# EAGLE design rc2usb (EAGLE 6.3)
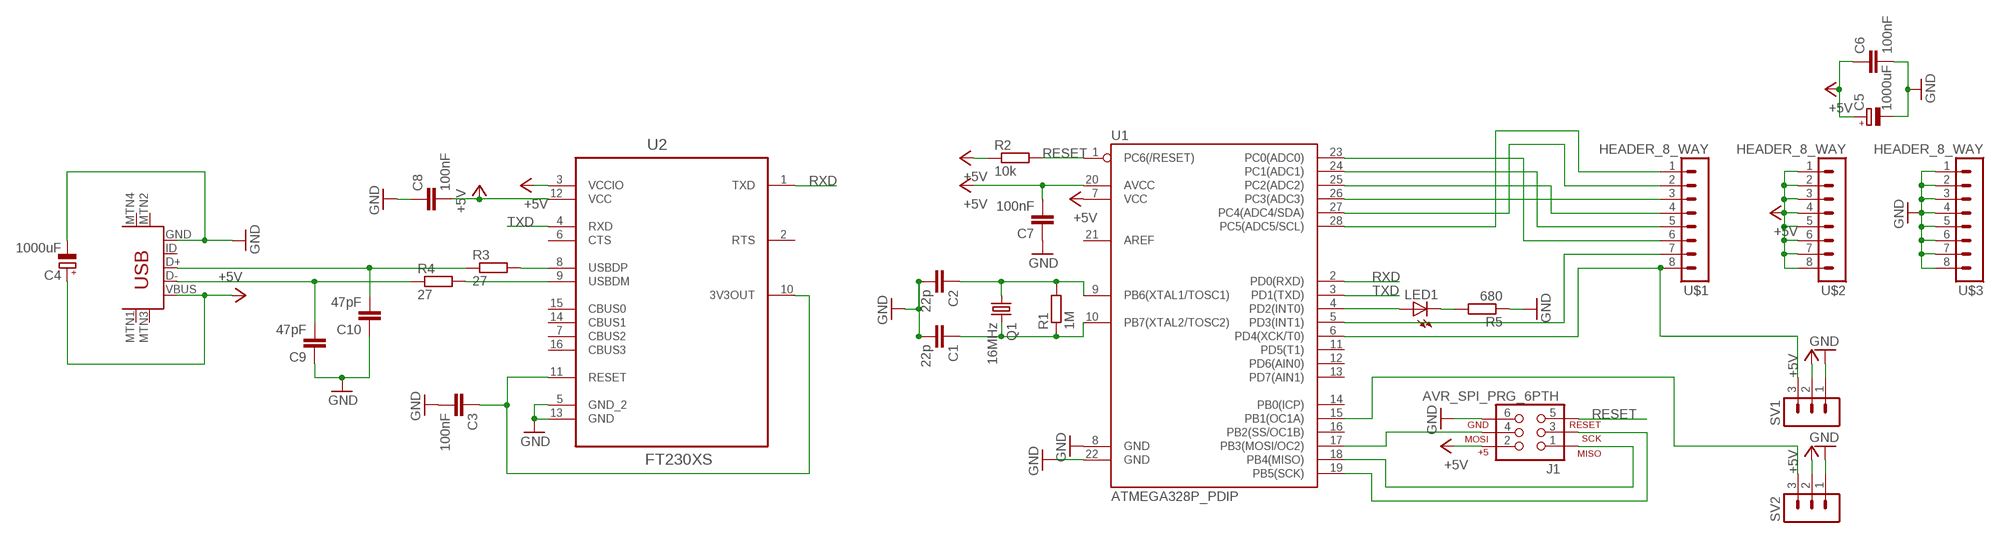
[diagram p0: schematic, sheet 1]

## Parts
C1  22p  C-EU025-040X050  [C025-040X050]
C2  22p  C-EU025-040X050  [C025-040X050]
C3  100nF  C-EU025-030X050  [C025-030X050]
C4  1000uF  CPOL-EUE5-10.5  [E5-10,5]
C5  1000uF  CPOL-EUE5-10.5  [E5-10,5]
C6  100nF  C-EU025-030X050  [C025-030X050]
C7  100nF  C-EU025-030X050  [C025-030X050]
C8  100nF  C-EU025-030X050  [C025-030X050]
C9  47pF  C-EU025-030X050  [C025-030X050]
C10  47pF  C-EU025-030X050  [C025-030X050]
J1  AVR_SPI_PRG_6PTH  [2X3]
LED1  LED5MM  [LED5MM]
Q1  16MHz  CRYSTALHC49U70  [HC49U70]
R1  1M  R-EU_0207/10  [0207/10]
R2  10k  R-EU_0207/10  [0207/10]
R3  27  R-EU_0207/10  [0207/10]
R4  27  R-EU_0207/10  [0207/10]
R5  680  R-EU_0207/10  [0207/10]
SV1  MA03-1  [MA03-1]
SV2  MA03-1  [MA03-1]
U1  ATMEGA328P_PDIP  [DIL28-3]
U2  FT230XS  [SOP63P600X175-16N]
U$1  HEADER_8_WAY  [HEADER_8_WAY]
U$2  HEADER_8_WAY  [HEADER_8_WAY]
U$3  HEADER_8_WAY  [HEADER_8_WAY]
U$4  USB-MINIB-5PIN  [USB-MINIB]

## Nets
+5V: C4.+ C5.+ C6.1 C7.2 C8.2 J1.2 R2.1 SV1.2 SV2.2 U1.7(VCC) U1.20(AVCC) U2.3(VCCIO) U2.12(VCC) U$2.1 U$2.2 U$2.3 U$2.4 U$2.5 U$2.6 U$2.7 U$2.8 U$4.VBUS
GND: C1.2 C2.2 C3.2 C4.- C5.- C6.2 C7.1 C8.1 C9.1 C10.1 J1.6 R5.1 SV1.1 SV2.1 U1.8(GND) U1.22(GND) U2.5(GND_2) U2.13(GND) U$3.1 U$3.2 U$3.3 U$3.4 U$3.5 U$3.6 U$3.7 U$3.8 U$4.GND
N$1: C2.1 Q1.1 R1.2 U1.9(PB6(XTAL1/TOSC1))
N$2: C1.1 Q1.2 R1.1 U1.10(PB7(XTAL2/TOSC2))
N$3: J1.4 U1.17(PB3(MOSI/OC2))
N$4: J1.1 U1.18(PB4(MISO))
N$5: J1.3 U1.19(PB5(SCK))
N$6: C10.2 R3.1 U$4.D+
N$7: C9.2 R4.1 U$4.D-
N$8: U1.24(PC1(ADC1)) U$1.5
N$9: R3.2 U2.8(USBDP)
N$10: LED1.A U1.4(PD2(INT0))
N$11: C3.1 U2.10(3V3OUT) U2.11(RESET)
N$12: R4.2 U2.9(USBDM)
N$14: U1.25(PC2(ADC2)) U$1.4
N$15: U1.26(PC3(ADC3)) U$1.3
N$16: U1.23(PC0(ADC0)) U$1.6
N$17: U1.27(PC4(ADC4/SDA)) U$1.2
N$18: U1.28(PC5(ADC5/SCL)) U$1.1
N$19: U1.5(PD3(INT1)) U$1.7
N$20: SV1.3 U1.6(PD4(XCK/T0)) U$1.8
N$22: SV2.3 U1.15(PB1(OC1A))
N$23: LED1.K(C) R5.2
RESET: J1.5 R2.2 U1.1(PC6(/RESET))
RXD: U1.2(PD0(RXD)) U2.1(TXD)
TXD: U1.3(PD1(TXD)) U2.4(RXD)
Unconnected: U1.11(PD5(T1)) U1.12(PD6(AIN0)) U1.13(PD7(AIN1)) U1.14(PB0(ICP)) U1.16(PB2(SS/OC1B)) U1.21(AREF) U2.2(RTS) U2.6(CTS) U2.7(CBUS2) U2.14(CBUS1) U2.15(CBUS0) U2.16(CBUS3) U$4.ID U$4.MTN1(MTN2) U$4.MTN2(MTN3) U$4.MTN3(MTN1) U$4.MTN4

## Library data of the parts
C1 C2 = resistor:C-EU: CAPACITOR, European symbol
C3 C6-C10 = rcl:C-EU: CAPACITOR, European symbol
C4 C5 = rcl:CPOL-EU: POLARIZED CAPACITOR, European symbol
J1 = SparkFun-Connectors:AVR_SPI_PRG_6: AVR ISP 6 Pin This is the reduced ISP connector for AVR programming. Common on Arduino. This footprint will take up less PCB space and can be used with a 10-pin to 6-pin adapter such as SKU: BOB-08508
LED1 = led:LED: LED OSRAM: - CHIPLED LG R971, LG N971, LY N971, LG Q971, LY Q971, LO R971, LY R971 LH N974, LH R974 LS Q976, LO Q976, LY Q976 LO Q996 - Hyper CHIPLED LW Q18S LB Q993, LB Q99A, LB R99A - SideLED LS A670, LO A670, LY A670, LG A670, LP A670 LB A673, LV A673, LT A673, LW A673 LH A674 LY A675 LS A676, LA A676, LO A676, LY A676, LW A676 LS A679, LY A679, LG A679 - Hyper Micro SIDELED® LS Y876, LA Y876, LO Y876, LY Y876 LT Y87S - SmartLED LW L88C, LW L88S LB L89C, LB L89S, LG L890 LS L89K, LO L89K, LY L89K LS L896, LA L896, LO L896, LY L896 - TOPLED LS T670, LO T670, LY T670, LG T670, LP T670 LSG T670, LSP T670, LSY T670, LOP T670, LYG T670 LG T671, LOG T671, LSG T671 LB T673, LV T673, LT T673, LW T673 LH T674 LS T676, LA T676, LO T676, LY T676, LB T676, LH T676, LSB T676, LW T676 LB T67C, LV T67C, LT T67C, LS T67K, LO T67K, LY T67K, LW E67C LS E67B, LA E67B, LO E67B, LY E67B, LB E67C, LV E67C, LT E67C LW T67C LS T679, LY T679, LG T679 LS T770, LO T770, LY T770, LG T770, LP T770 LB T773, LV T773, LT T773, LW T773 LH T774 LS E675, LA E675, LY E675, LS T675 LS T776, LA T776, LO T776, LY T776, LB T776 LHGB T686 LT T68C, LB T68C - Hyper Mini TOPLED® LB M676 - Mini TOPLED Santana® LG M470 LS M47K, LO M47K, LY M47K Source: http://www.osram.convergy.de LUXEON: - LUMILED® LXK2-PW12-R00, LXK2-PW12-S00, LXK2-PW14-U00, LXK2-PW14-V00 LXK2-PM12-R00, LXK2-PM12-S00, LXK2-PM14-U00 LXK2-PE12-Q00, LXK2-PE12-R00, LXK2-PE12-S00, LXK2-PE14-T00, LXK2-PE14-U00 LXK2-PB12-K00, LXK2-PB12-L00, LXK2-PB12-M00, LXK2-PB14-N00, LXK2-PB14-P00, LXK2-PB14-Q00 LXK2-PR12-L00, LXK2-PR12-M00, LXK2-PR14-Q00, LXK2-PR14-R00 LXK2-PD12-Q00, LXK2-PD12-R00, LXK2-PD12-S00 LXK2-PH12-R00, LXK2-PH12-S00 LXK2-PL12-P00, LXK2-PL12-Q00, LXK2-PL12-R00 Source: www.luxeon.com KINGBRIGHT: KA-3528ASYC Source: www.kingbright.com
Q1 = crystal:CRYSTAL: CRYSTAL; OC_FARNELL: unknown; OC_NEWARK: unknown
R1-R5 = resistor:R-EU_: RESISTOR, European symbol
SV1 SV2 = con-lstb:MA03-1: PIN HEADER; OC_FARNELL: unknown; OC_NEWARK: unknown
U1 = SparkFun-DigitalIC:ATMEGA328P_PDIP: uC used in the Arduino 32kb flash, 1k EEPROM, 2k SRAM This is the through-hole version of this chip.
U2 = rc2usb:FT230XS: I/F, USB2.0 FS TO BASIC UART; MPN: FT230XS; OC_FARNELL: 2081321; OC_NEWARK: 83T7087; PACKAGE: SSOP-16; SUPPLIER: FTDI
U$1-U$3 = rc2usb:HEADER_8_WAY
U$4 = SparkFun-Connectors:USB-MINIB: Mini-USB "B" connector with 5th pin broken out. Created new symbol breaking out 5th "ID" pin in mini/micro USB connector spec. See: http://en.wikipedia.org/wiki/Mini_usb#Cables. Uses same footprint as 4-pin symbol. Also added pins to connect to mounting / shield pads if required (probably not generally needed as signals aren't shielded once they leave the connector).

## Board
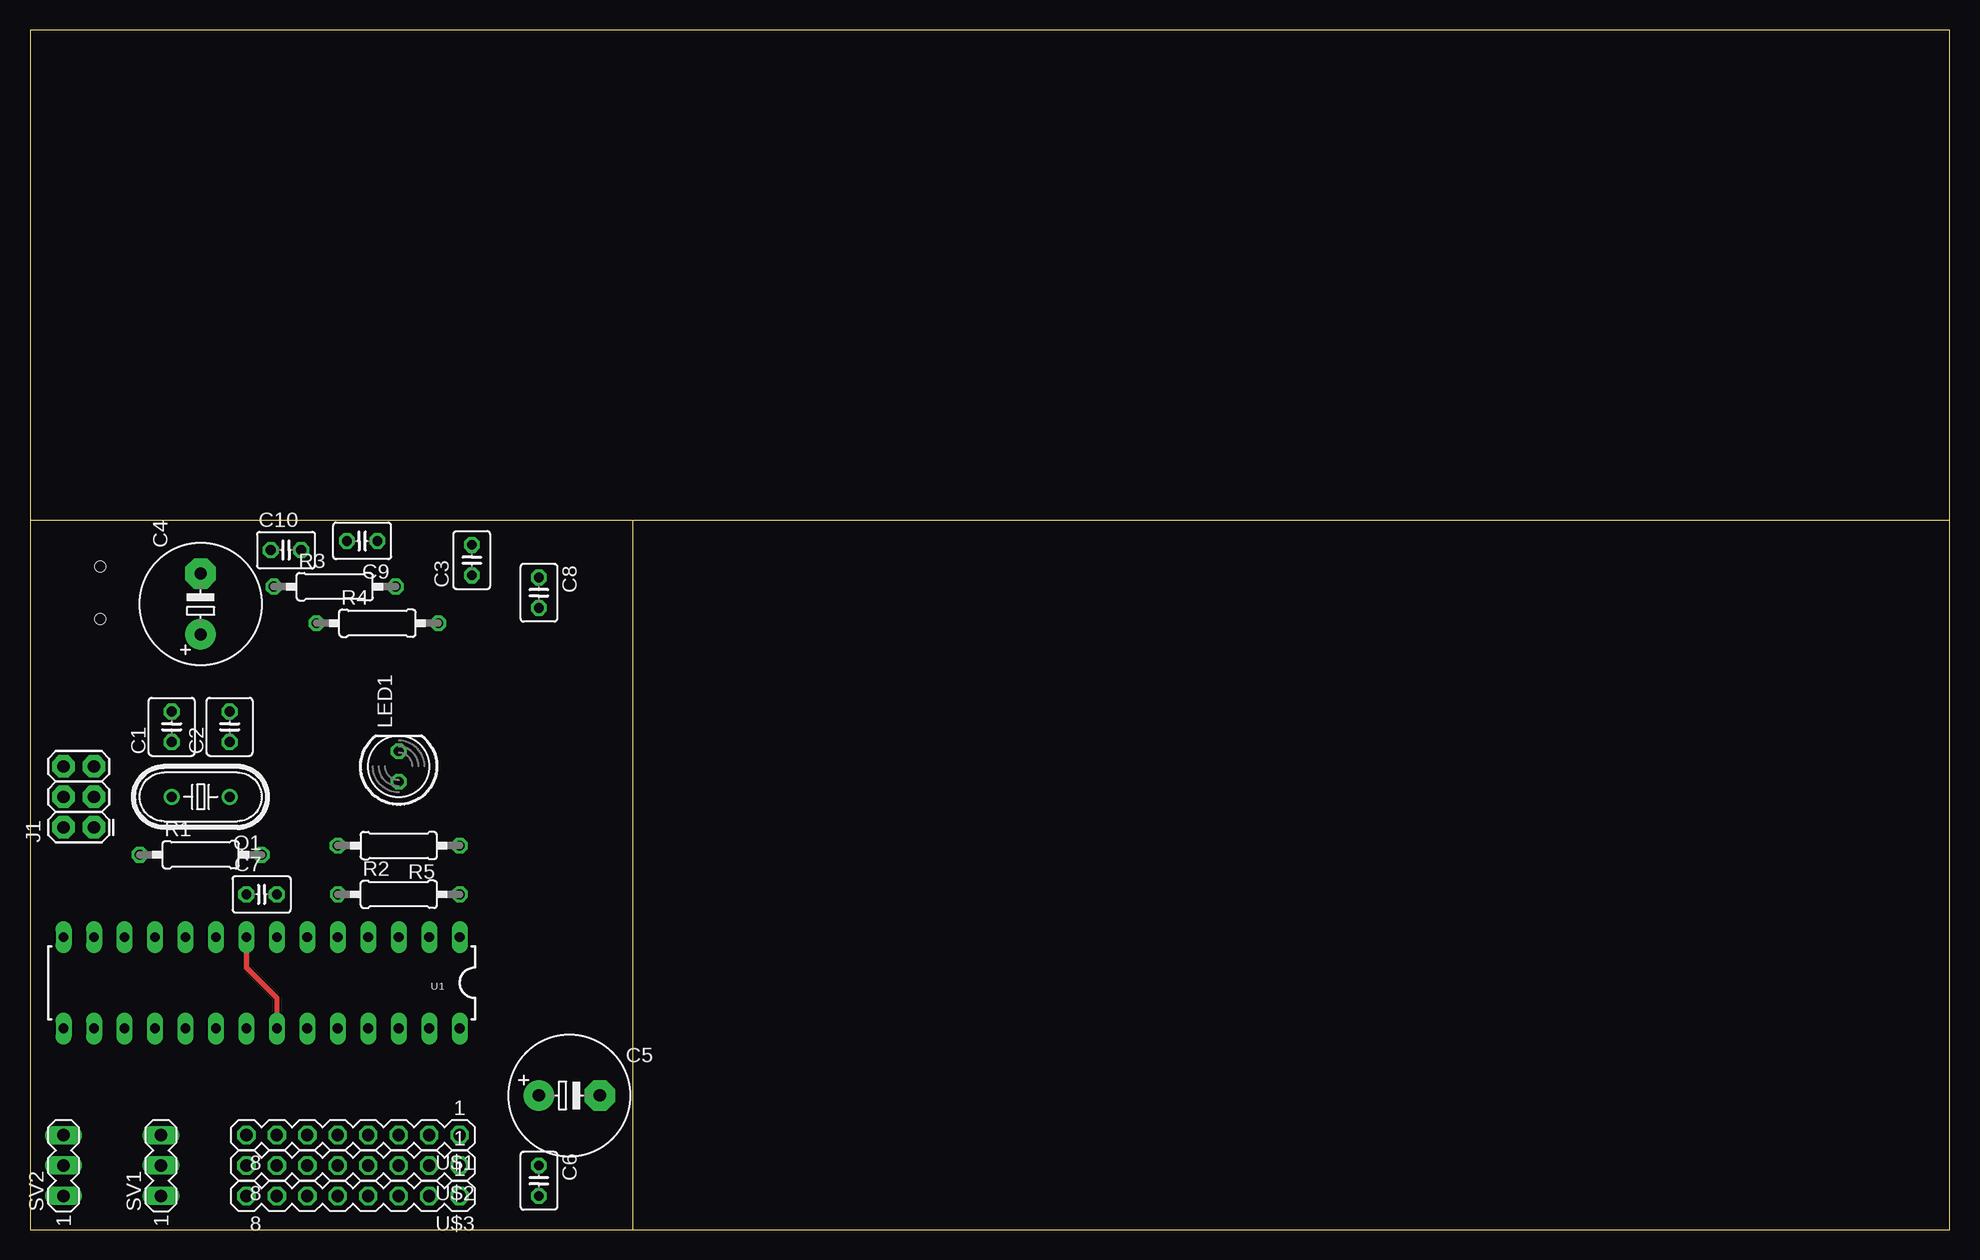
[diagram p1: board, top side]
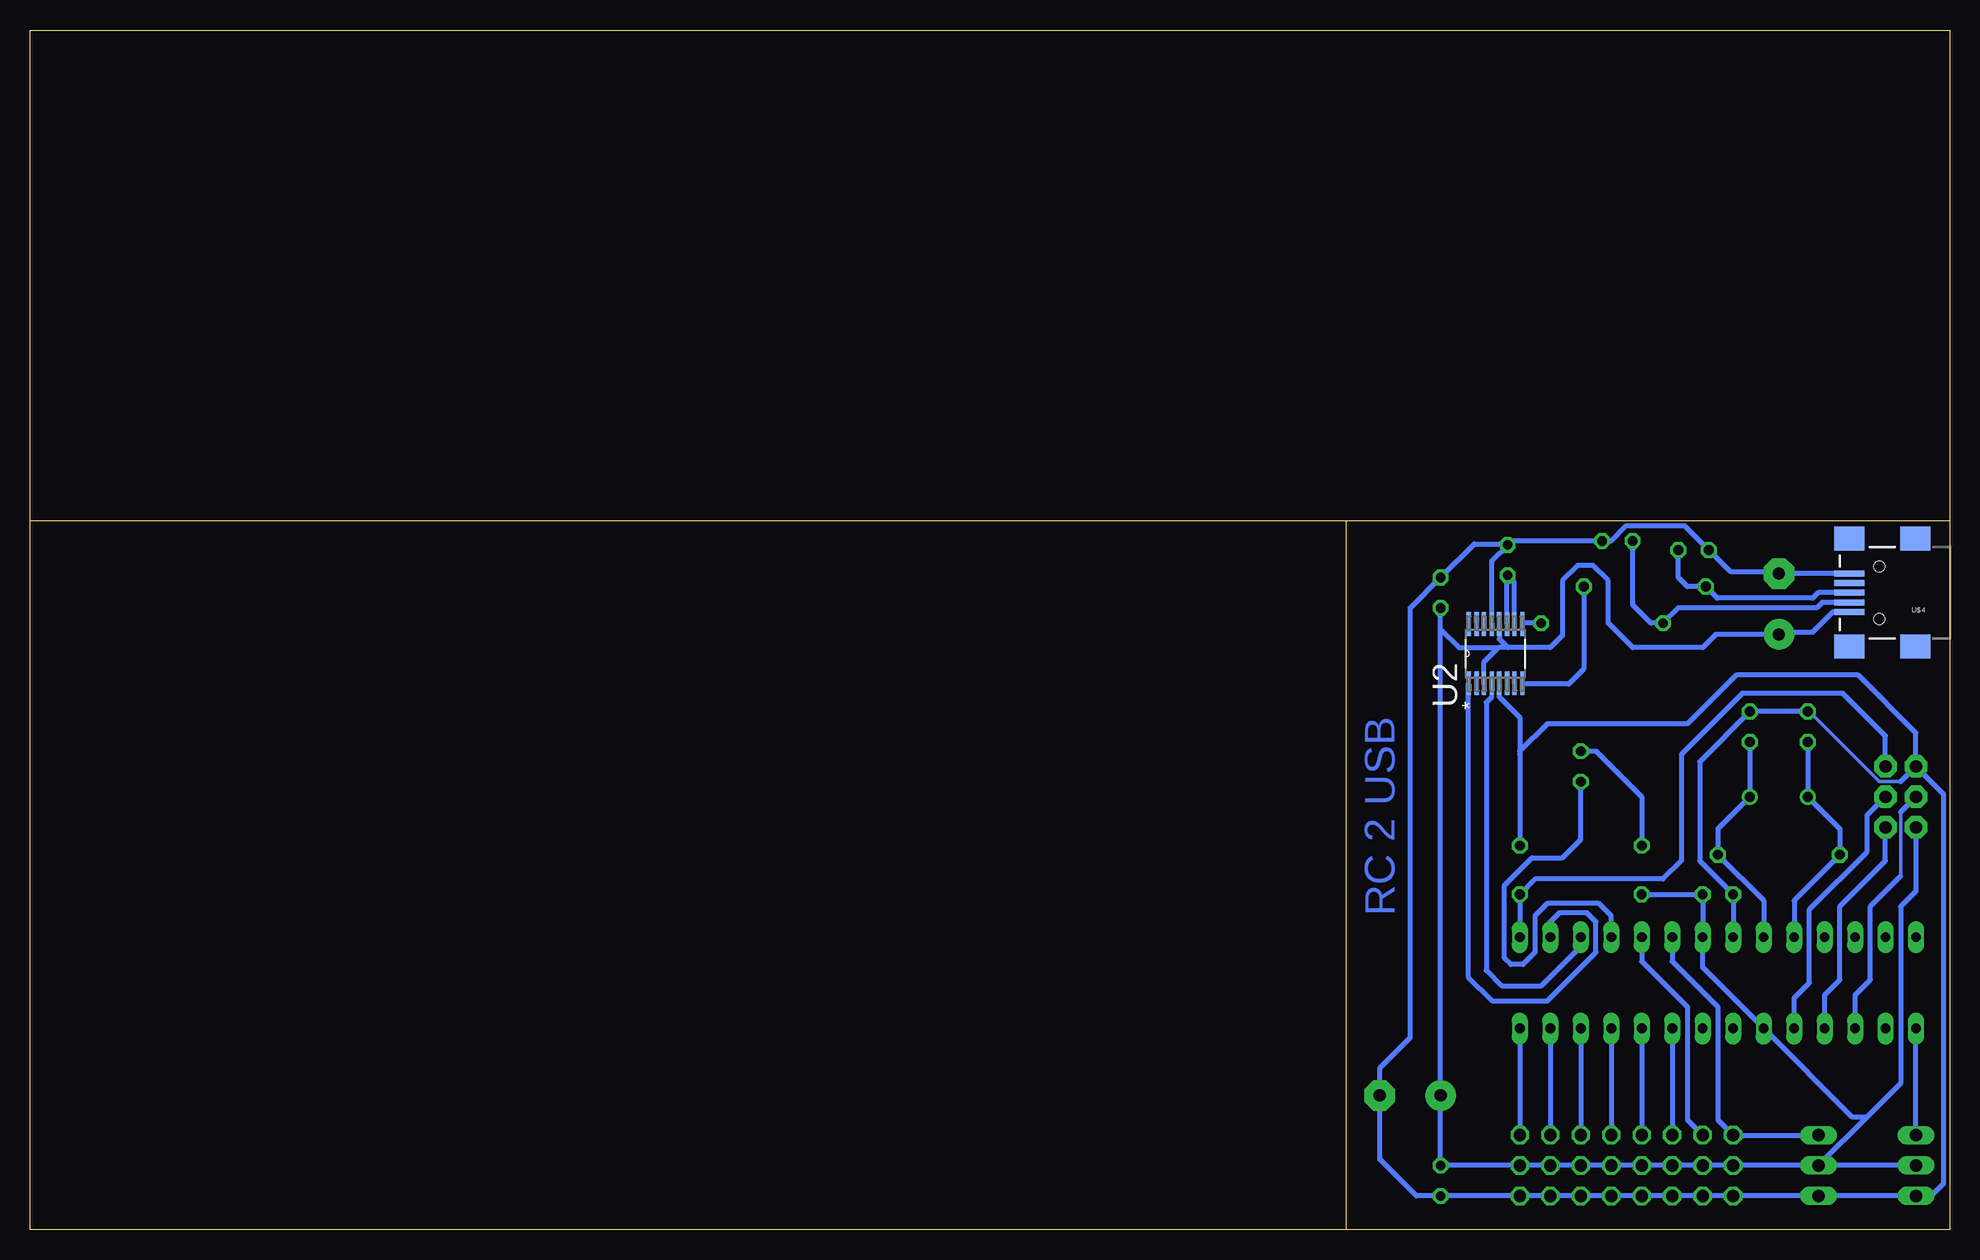
[diagram p2: board, bottom side, seen from below]

Size 160 x 100 mm. Coordinates in mm from the lower left corner, seen from the top.
Outline: 50.27,0 0,0 0,59.11
Outline: 50.27,0 160,0 160,59.11
Outline: 160,59.11 160,100 0,100 0,59.11
Outline: 160,59.11 50.27,59.11
Outline: 50.27,59.11 0,59.11
Outline: 50.27,0 50.27,59.11
Copper layers (1*16): Top 0.035mm / dielectric 1.5mm / Bottom 0.035mm
Design rules "default": minimum track width 10mil, minimum drill 24mil, track to track 8mil, track to pad 8mil, pad to pad 8mil, via to via 8mil, smd to smd 8mil, copper to edge 40mil, drill to drill 8mil, minimum pad ring 10mil, minimum via ring 8mil, stop-mask expansion 4mil, vias tented up to drill 0mil, thermal gap 10mil

### Footprints (pad centres in the part's own frame; a part is rotated, then mirrored left to right if it is on the bottom)
C025-040X050 = drill 0.813 octagon: 1 -1.27,0; 2 1.27,0
C025-030X050 = drill 0.813 octagon: 1 -1.27,0; 2 1.27,0
E5-10,5 = drill 1.016 pad 2.54: + -2.54,0 | drill 1.016 pad 2.54 octagon: - 2.54,0
2X3 = drill 1.016 pad 1.88 octagon: 1 0,0; 2 0,2.54; 3 2.54,0; 4 2.54,2.54; 5 5.08,0; 6 5.08,2.54
LED5MM = drill 0.813 octagon: A -1.27,0; K 1.27,0
HC49U70 = drill 0.813: 1 -2.413,0; 2 2.413,0
0207/10 = drill 0.813 octagon: 1 -5.08,0; 2 5.08,0
MA03-1 = drill 1.016 long: 1 -2.54,0; 2 0,0; 3 2.54,0
DIL28-3 = drill 0.813 long: 1 -16.51,-3.81; 2 -13.97,-3.81; 3 -11.43,-3.81; 4 -8.89,-3.81; 5 -6.35,-3.81; 6 -3.81,-3.81; 7 -1.27,-3.81; 8 1.27,-3.81; 9 3.81,-3.81; 10 6.35,-3.81; 11 8.89,-3.81; 12 11.43,-3.81; 13 13.97,-3.81; 14 16.51,-3.81; 15 16.51,3.81; 16 13.97,3.81; 17 11.43,3.81; 18 8.89,3.81; 19 6.35,3.81; 20 3.81,3.81; 21 1.27,3.81; 22 -1.27,3.81; 23 -3.81,3.81; 24 -6.35,3.81; 25 -8.89,3.81; 26 -11.43,3.81; 27 -13.97,3.81; 28 -16.51,3.81
SOP63P600X175-16N = smd 1.981 x 0.356: 1 -2.464,2.235; 2 -2.464,1.575; 3 -2.464,0.965; 4 -2.464,0.305; 5 -2.464,-0.305; 6 -2.464,-0.965; 7 -2.464,-1.575; 8 -2.464,-2.235; 9 2.464,-2.235; 10 2.464,-1.575; 11 2.464,-0.965; 12 2.464,-0.305; 13 2.464,0.305; 14 2.464,0.965; 15 2.464,1.575; 16 2.464,2.235
HEADER_8_WAY = drill 1.016 octagon: 1 -8.89,0; 2 -6.35,0; 3 -3.81,0; 4 -1.27,0; 5 1.27,0; 6 3.81,0; 7 6.35,0; 8 8.89,0
USB-MINIB = smd 2.5 x 0.5: D+ 2.5,0; D- 2.5,0.8; GND 2.5,-1.6; ID 2.5,-0.8; VBUS 2.5,1.6 | smd 2.5 x 2: MTN1 -3,4.5; MTN2 2.5,4.5; MTN3 -3,-4.5; MTN4 2.5,-4.5 | hole 0.9: 0,2.2; 0,-2.2

### Placement (x,y rotation side)
C1  11.81,41.91 90 top
C2  16.64,41.91 90 top
C3  36.83,55.8 90 top
C4  14.22,52.15 90 top
C5  44.96,11.18 0 top
C6  42.42,4.06 270 top
C7  19.3,27.94 0 top
C8  42.42,53.09 270 top
C9  27.69,57.4 180 top
C10  21.34,56.64 0 top
J1  5.33,33.53 90 top
LED1  30.73,38.61 90 top
Q1  14.22,36.07 180 top
R1  14.22,31.24 0 top
R2  30.74,27.94 0 top
R3  25.4,53.59 0 top
R4  28.96,50.55 0 top
R5  30.73,32 180 top
SV1  10.92,5.33 90 top
SV2  2.79,5.33 90 top
U1  19.3,20.57 180 top
U2  37.85,48.01 90 bottom
U$1  26.92,7.87 180 top
U$2  26.92,5.33 180 top
U$3  26.92,2.79 180 top
U$4  5.84,53.09 180 bottom

### Tracks (layer width: path | path; a pad name or v marks a point on that pad's centre or on a via)
+5V
  Bottom 0.406: SV2.2 SV1.2 | SV1.2 U$2.8 U$2.7 U$2.6 U$2.5 U$2.4 U$2.3 U$2.2 U$2.1 C6.1 C5.+ 42.42,50.04 | J1.2 2.79,28.19 4.06,26.92 4.06,12.19 6.86,9.4 | 6.86,9.4 SV1.2 | 6.86,9.4 8.13,9.4 U1.20 20.57,21.84 U1.7 C7.2 R2.1 | U$4.VBUS 9.73,51.49 11.43,49.78 14.05,49.78 C4.+ 19.48,49.61 20.57,48.51 26.42,48.51 28.45,50.55 28.45,54.1 29.72,55.37 30.99,55.37 32.26,54.1 32.26,49.53 33.27,48.51 36.83,48.51 | U2.3 38.81,47.3 37.59,48.51 | 36.83,48.51 37.59,48.51 | 37.59,48.51 40.89,48.51 42.42,50.04 | 42.42,50.04 C8.2 | U2.12 37.54,49.23 36.83,48.51
GND
  Top 0.406: U1.8 18.03,21.84 20.57,19.3 U1.22
  Bottom 0.305: 11.68,43.18 5.84,37.34 4.06,37.34 | U2.5 37.54,44.4
  Bottom 0.406: U1.8 C7.1 20.83,30.73 20.83,38.99 C2.2 C1.2 11.68,43.18 | U$4.GND C4.- | C4.- | J1.6 0.51,36.32 0.51,3.81 1.52,2.79 SV2.1 SV1.1 U$3.8 U$3.7 U$3.6 U$3.5 U$3.4 U$3.3 U$3.2 U$3.1 C6.2 44.45,2.79 47.5,5.84 C5.- 47.5,13.46 44.96,16 44.96,51.82 C8.1 39.62,57.15 36.91,57.15 C3.2 | J1.6 2.79,41.4 7.62,46.23 17.78,46.23 21.84,42.16 33.53,42.16 35.81,39.88 | 35.81,39.88 35.81,39.62 R5.1 | 4.06,37.34 J1.6 | C4.- 14.4,54.86 18.29,54.86 C10.1 22.1,58.67 26.92,58.67 28.19,57.4 C9.1 36.5,57.4 C3.2 | C3.2 37.01,57.07 37.08,57.15 | U2.13 38.15,55.75 C3.2 | 37.54,44.4 35.81,42.67 35.81,39.88
N$1
  Bottom 0.406: U1.9 15.49,27.43 R1.2 19.3,33.4 Q1.1 C2.1
N$2
  Bottom 0.406: U1.10 12.95,27.43 R1.1 9.14,33.4 Q1.2 C1.1
N$3
  Bottom 0.305: 4.06,29.46 4.06,34.8
  Bottom 0.406: U1.17 7.87,19.56 6.6,20.83 6.6,26.92 4.06,29.46 | 4.06,34.8 J1.4
N$4
  Bottom 0.406: U1.18 10.41,19.56 9.14,20.83 9.14,26.92 5.33,30.73 J1.1
N$5
  Bottom 0.406: U1.19 12.95,19.3 11.68,20.57 11.68,26.67 6.86,31.5 6.86,34.54 J1.3
N$6
  Bottom 0.406: U$4.D+ 10.92,53.09 11.4,52.63 19.36,52.63 R3.1 21.84,53.59 22.61,54.36 C10.2
N$7
  Bottom 0.406: U$4.D- 10.6,52.29 11.07,51.82 22.61,51.82 R4.1 24.89,50.55 26.42,52.07 C9.2
N$8
  Bottom 0.406: U1.24 U$1.5
N$9
  Bottom 0.406: R3.2 30.48,46.74 31.75,45.47 35.53,45.47 U2.8
N$10
  Bottom 0.406: U1.4 28.19,26.16 29.21,27.18 33.53,27.18 34.54,26.16 34.54,23.11 35.56,22.1 36.58,22.1 37.08,22.61 37.08,28.7 34.8,30.99 32.26,30.99 30.73,32.51 LED1.A
N$11
  Bottom 0.406: U2.11 36.88,54.48 C3.1 36.27,53.98 U2.10
N$12
  Bottom 0.406: R4.2 35.53,50.55 U2.9
N$14
  Bottom 0.406: U1.25 U$1.4
N$15
  Bottom 0.406: 30.73,17.02 U1.26 U$1.3
N$16
  Bottom 0.406: U1.23 U$1.6
N$17
  Bottom 0.406: U1.27 U$1.2
N$18
  Bottom 0.406: U1.28 U$1.1
N$19
  Bottom 0.406: U1.5 25.65,22.35 21.84,18.54 21.84,9.14 U$1.7
N$20
  Bottom 0.406: U1.6 23.11,22.35 19.3,18.54 19.3,9.14 U$1.8 SV1.3
N$22
  Bottom 0.406: SV2.3 U1.15
N$23
  Bottom 0.406: LED1.K 29.46,39.88 25.65,36.07 R5.2
RESET
  Bottom 0.406: U1.1 R2.2 34.55,29.21 23.88,29.21 22.35,30.73 22.35,39.62 17.27,44.7 8.89,44.7 5.33,41.15 J1.5
RXD
  Bottom 0.406: U1.2 33.27,25.65 32.51,26.42 30.23,26.42 29.46,25.65 29.46,23.11 33.53,19.05 38.1,19.05 40.13,21.08 40.13,45.49 U2.1
TXD
  Bottom 0.305: U2.4 38.15,44.4
  Bottom 0.406: U1.3 30.73,23.62 34.04,20.32 37.34,20.32 38.61,21.59 38.61,43.94 38.15,44.4

### Text on the board
Bottom: RC 2 USB